# EAGLE design mcp4902 (EAGLE 6.4)
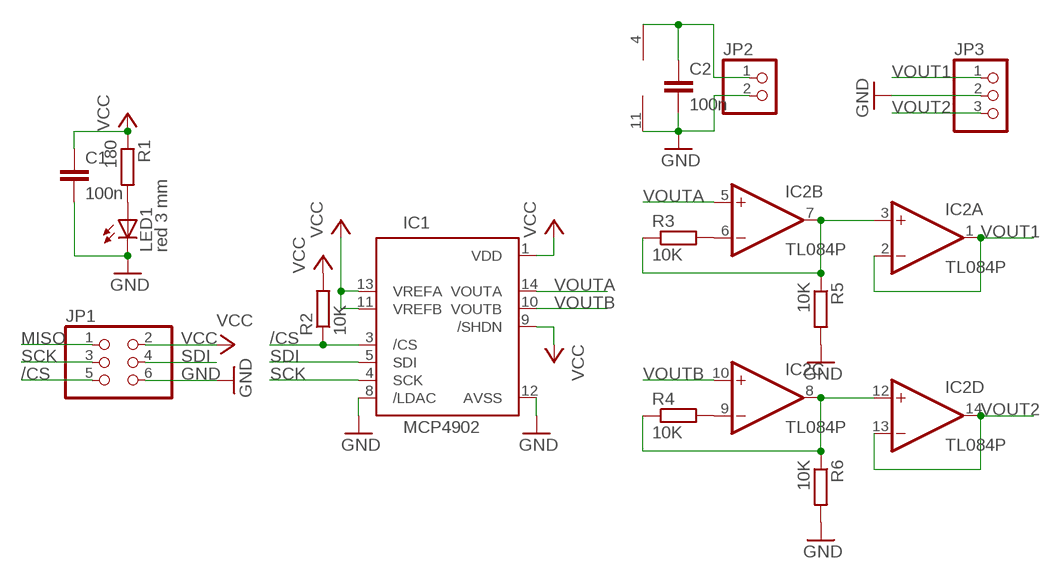
[diagram p0: schematic, sheet 1]

## Parts
C1  100n  C-EU050-024X044  [C050-024X044]
C2  100n  C-EU050-024X044  [C050-024X044]
IC1  MCP4902  MCP4922  [DIL14]
IC2  TL084P  [DIL14]
JP1  PINHD-2X3  [2X03]
JP2  PINHD-1X2  [1X02]
JP3  PINHD-1X3  [1X03]
LED1  red 3 mm  LED3MM  [LED3MM]
R1  180  R-EU_0204/2V  [0204V]
R2  10K  R-EU_0204/2V  [0204V]
R3  10K  R-EU_0204/2V  [0204V]
R4  10K  R-EU_0204/2V  [0204V]
R5  10K  R-EU_0204/2V  [0204V]
R6  10K  R-EU_0204/2V  [0204V]

## Nets
/CS: IC1.3(/CS) JP1.5 R2.1
GND: C1.2 C2.2 IC1.8(/LDAC) IC1.12(AVSS) IC2.11(P:V-) JP1.6 JP2.2 JP3.2 LED1.K(C) R5.2 R6.2
MISO: JP1.1
N$1: LED1.A R1.2
N$2: IC2.6(B:-IN) R3.2
N$3: IC2.9(C:-IN) R4.2
N$7: IC2.3(A:+IN) IC2.7(B:OUT) R3.1 R5.1
N$8: IC2.8(C:OUT) IC2.12(D:+IN) R4.1 R6.1
SCK: IC1.4(SCK) JP1.3
SDI: IC1.5(SDI) JP1.4
V+: C2.1 IC2.4(P:V+) JP2.1
VCC: C1.1 IC1.1(VDD) IC1.9(/SHDN) IC1.11(VREFB) IC1.13(VREFA) JP1.2 R1.1 R2.2
VOUT1: IC2.1(A:OUT) IC2.2(A:-IN) JP3.1
VOUT2: IC2.13(D:-IN) IC2.14(D:OUT) JP3.3
VOUTA: IC1.14(VOUTA) IC2.5(B:+IN)
VOUTB: IC1.10(VOUTB) IC2.10(C:+IN)

## Library data of the parts
C1 C2 = rcl:C-EU: CAPACITOR, European symbol
IC1 = Peripherals:MCP4922: 12-Bit DAC with SPI Interface
IC2 = linear:TL084: OP AMP
JP1 = pinhead:PINHD-2X3: PIN HEADER
JP2 = pinhead:PINHD-1X2: PIN HEADER
JP3 = pinhead:PINHD-1X3: PIN HEADER
LED1 = led:LED: LED OSRAM: - CHIPLED LG R971, LG N971, LY N971, LG Q971, LY Q971, LO R971, LY R971 LH N974, LH R974 LS Q976, LO Q976, LY Q976 LO Q996 - Hyper CHIPLED LW Q18S LB Q993, LB Q99A, LB R99A - SideLED LS A670, LO A670, LY A670, LG A670, LP A670 LB A673, LV A673, LT A673, LW A673 LH A674 LY A675 LS A676, LA A676, LO A676, LY A676, LW A676 LS A679, LY A679, LG A679 - Hyper Micro SIDELED® LS Y876, LA Y876, LO Y876, LY Y876 LT Y87S - SmartLED LW L88C, LW L88S LB L89C, LB L89S, LG L890 LS L89K, LO L89K, LY L89K LS L896, LA L896, LO L896, LY L896 - TOPLED LS T670, LO T670, LY T670, LG T670, LP T670 LSG T670, LSP T670, LSY T670, LOP T670, LYG T670 LG T671, LOG T671, LSG T671 LB T673, LV T673, LT T673, LW T673 LH T674 LS T676, LA T676, LO T676, LY T676, LB T676, LH T676, LSB T676, LW T676 LB T67C, LV T67C, LT T67C, LS T67K, LO T67K, LY T67K, LW E67C LS E67B, LA E67B, LO E67B, LY E67B, LB E67C, LV E67C, LT E67C LW T67C LS T679, LY T679, LG T679 LS T770, LO T770, LY T770, LG T770, LP T770 LB T773, LV T773, LT T773, LW T773 LH T774 LS E675, LA E675, LY E675, LS T675 LS T776, LA T776, LO T776, LY T776, LB T776 LHGB T686 LT T68C, LB T68C - Hyper Mini TOPLED® LB M676 - Mini TOPLED Santana® LG M470 LS M47K, LO M47K, LY M47K Source: http://www.osram.convergy.de LUXEON: - LUMILED® LXK2-PW12-R00, LXK2-PW12-S00, LXK2-PW14-U00, LXK2-PW14-V00 LXK2-PM12-R00, LXK2-PM12-S00, LXK2-PM14-U00 LXK2-PE12-Q00, LXK2-PE12-R00, LXK2-PE12-S00, LXK2-PE14-T00, LXK2-PE14-U00 LXK2-PB12-K00, LXK2-PB12-L00, LXK2-PB12-M00, LXK2-PB14-N00, LXK2-PB14-P00, LXK2-PB14-Q00 LXK2-PR12-L00, LXK2-PR12-M00, LXK2-PR14-Q00, LXK2-PR14-R00 LXK2-PD12-Q00, LXK2-PD12-R00, LXK2-PD12-S00 LXK2-PH12-R00, LXK2-PH12-S00 LXK2-PL12-P00, LXK2-PL12-Q00, LXK2-PL12-R00 Source: www.luxeon.com KINGBRIGHT: KA-3528ASYC Source: www.kingbright.com
R1-R6 = resistor:R-EU_: RESISTOR, European symbol

## Board
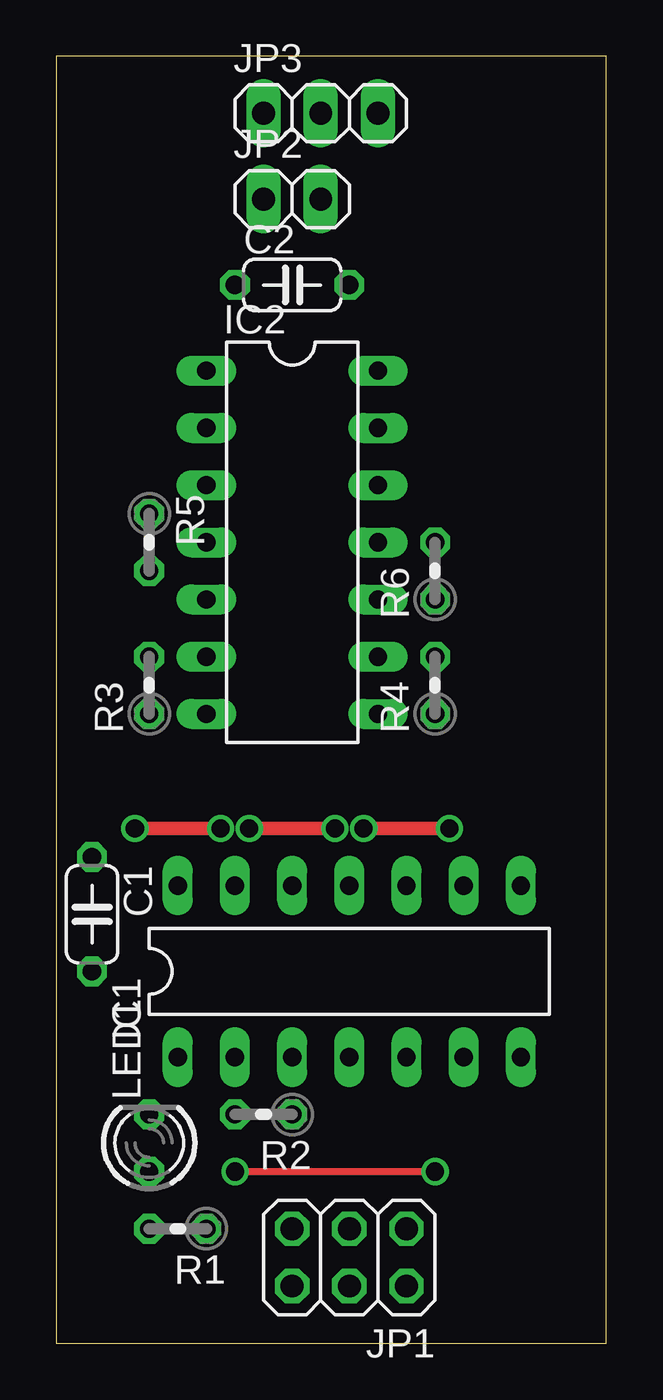
[diagram p1: board, top side]
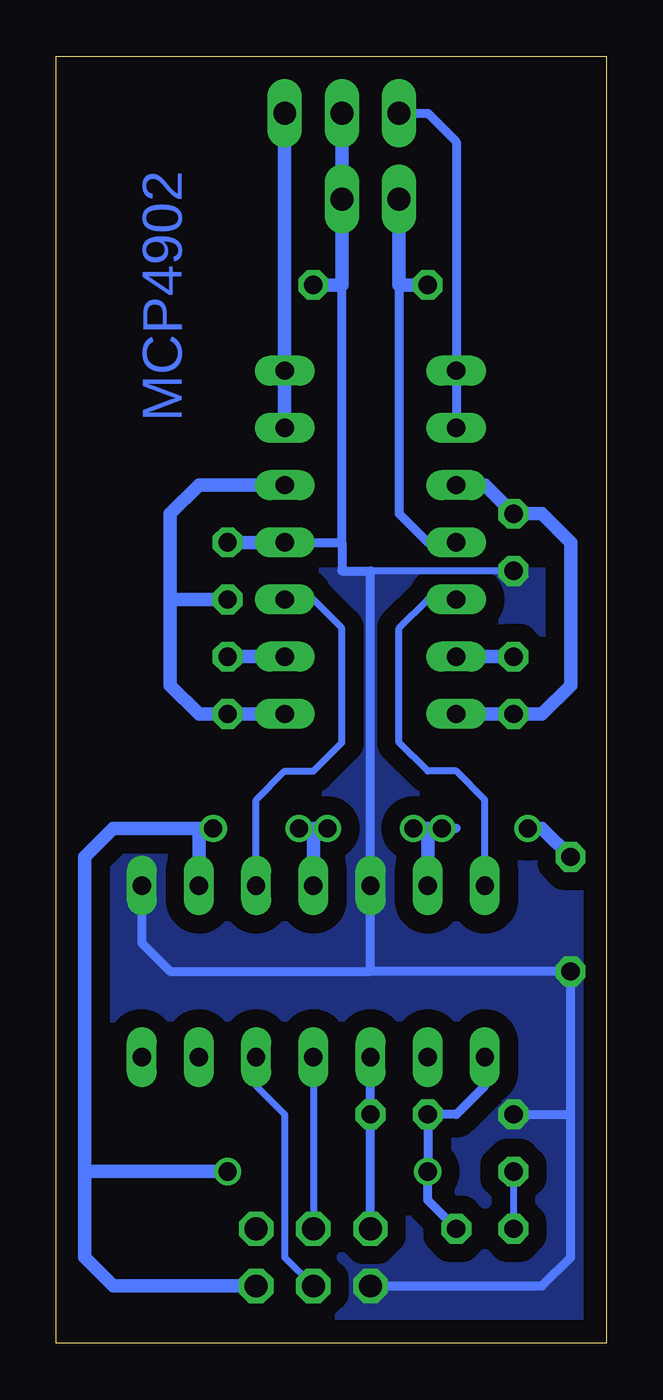
[diagram p2: board, bottom side, seen from below]

Size 24.44 x 57.14 mm. Coordinates in mm from the lower left corner, seen from the top.
Outline: 0,0 24.44,0 24.44,57.14 0,57.14 0,0
Copper layers (1*16): Top 0.035mm / dielectric 1.5mm / Bottom 0.035mm
Design rules "default": minimum track width 10mil, minimum drill 24mil, track to track 8mil, track to pad 8mil, pad to pad 8mil, via to via 8mil, smd to smd 8mil, copper to edge 40mil, drill to drill 8mil, minimum pad ring 10mil, minimum via ring 8mil, stop-mask expansion 4mil, vias tented up to drill 0mil, thermal gap 10mil

### Footprints (pad centres in the part's own frame; a part is rotated, then mirrored left to right if it is on the bottom)
C050-024X044 = drill 0.813 octagon: 1 -2.54,0; 2 2.54,0
DIL14 = drill 0.813 long: 1 -7.62,-3.81; 2 -5.08,-3.81; 3 -2.54,-3.81; 4 0,-3.81; 5 2.54,-3.81; 6 5.08,-3.81; 7 7.62,-3.81; 8 7.62,3.81; 9 5.08,3.81; 10 2.54,3.81; 11 0,3.81; 12 -2.54,3.81; 13 -5.08,3.81; 14 -7.62,3.81
2X03 = drill 1.016 octagon: 1 -2.54,-1.27; 2 -2.54,1.27; 3 0,-1.27; 4 0,1.27; 5 2.54,-1.27; 6 2.54,1.27
1X02 = drill 1.016 long: 1 -1.27,0; 2 1.27,0
1X03 = drill 1.016 long: 1 -2.54,0; 2 0,0; 3 2.54,0
LED3MM = drill 0.813 octagon: A -1.27,0; K 1.27,0
0204V = drill 0.813 octagon: 1 -1.27,0; 2 1.27,0

### Placement (x,y rotation side)
C1  1.59,19.05 270 top
C2  10.48,46.99 0 top
IC1  13.02,16.51 0 top
IC2  10.48,35.56 270 top
JP1  13.02,3.81 180 top
JP2  10.48,50.8 0 top
JP3  11.75,54.61 0 top
LED1  4.13,8.89 90 top
R1  5.4,5.08 180 top
R2  9.21,10.16 180 top
R3  4.13,29.21 90 top
R4  16.83,29.21 90 top
R5  4.13,35.56 270 top
R6  16.83,34.29 90 top

### Tracks (layer width: path | path; a pad name or v marks a point on that pad's centre or on a via)
/CS
  Bottom 0.406: JP1.5 R2.1 IC1.3
GND
  Bottom 0.305: R5.2 10.48,34.29
  Bottom 0.406: JP1.6 2.86,2.54 1.59,3.81 1.59,10.16 | 1.59,10.16 C1.2 10.48,16.51 | LED1.K 1.59,10.16 | IC2.11 11.75,35.56 | 11.75,35.56 11.75,46.99 | IC1.8 20.64,17.78 19.37,16.51 10.48,16.51 | 10.48,16.51 IC1.12 10.48,34.29 11.75,34.29 11.75,35.56
  Bottom 0.61: JP3.2 JP2.2 11.75,46.99 C2.2 | R6.2 IC2.11
  pour Bottom (isolate 0.813, no thermals): 24.45,0 0.32,0 0.32,34.29 24.45,34.29
N$1
  Bottom 0.305: LED1.A R1.2
N$2
  Bottom 0.61: IC2.6 R3.2
N$3
  Bottom 0.61: IC2.9 R4.2
N$7
  Bottom 0.61: IC2.7 R3.1 2.86,27.94 1.59,29.21 1.59,35.56 2.86,36.83 R5.1 5.4,38.1 IC2.3
N$8
  Bottom 0.61: IC2.8 R4.1 18.1,27.94 19.37,29.21 19.37,33.02 | IC2.12 18.1,38.1 19.37,36.83 19.37,33.02 | R6.1 19.37,33.02
SCK
  Bottom 0.305: IC1.4 JP1.3
SDI
  Bottom 0.305: IC1.5 15.56,11.43 14.29,10.16 14.29,3.81 JP1.4
V+
  Bottom 0.305: 7.94,35.56 IC2.4
  Bottom 0.406: 9.21,46.99 9.21,36.83 7.94,35.56
  Bottom 0.61: JP2.1 9.21,46.99 C2.1
VCC  (via drill 0.8)
  Top 0.305: v7.94,7.62 v16.83,7.62
  Top 0.61: v17.46,22.86 v13.65,22.86 | v3.49,22.86 v7.3,22.86 | v12.38,22.86 v8.57,22.86
  Bottom 0.406: v7.3,22.86 6.67,22.86 | IC1.1 5.4,11.43 6.67,10.16 R2.2 v7.94,7.62 7.94,6.35 R1.1
  Bottom 0.61: C1.1 2.86,22.86 v3.49,22.86 | 23.18,7.62 23.18,3.81 21.91,2.54 JP1.2 | 23.18,7.62 23.18,21.59 21.91,22.86 18.1,22.86 | 18.1,22.86 v17.46,22.86 | 7.94,22.86 v8.57,22.86 | IC1.13 7.94,22.86 | 7.94,22.86 v7.3,22.86 | 13.02,22.86 v12.38,22.86 | IC1.11 13.02,22.86 | 13.02,22.86 v13.65,22.86 | IC1.9 18.1,22.86 | v16.83,7.62 23.18,7.62
VOUT1
  Bottom 0.406: JP3.1 7.94,54.61 6.67,53.34 IC2.1 IC2.2
VOUT2
  Bottom 0.61: JP3.3 IC2.14 IC2.13
VOUTA
  Bottom 0.305: IC1.14 5.4,24.13 6.67,25.4 7.94,25.4 9.21,26.67 9.21,31.75 7.94,33.02 IC2.5
VOUTB
  Bottom 0.305: IC1.10 15.56,24.13 14.29,25.4 13.02,25.4 11.75,26.67 11.75,31.75 13.02,33.02 IC2.10

### Text on the board
Bottom: MCP4902